# EAGLE design lzond1 (EAGLE 7.2.0)
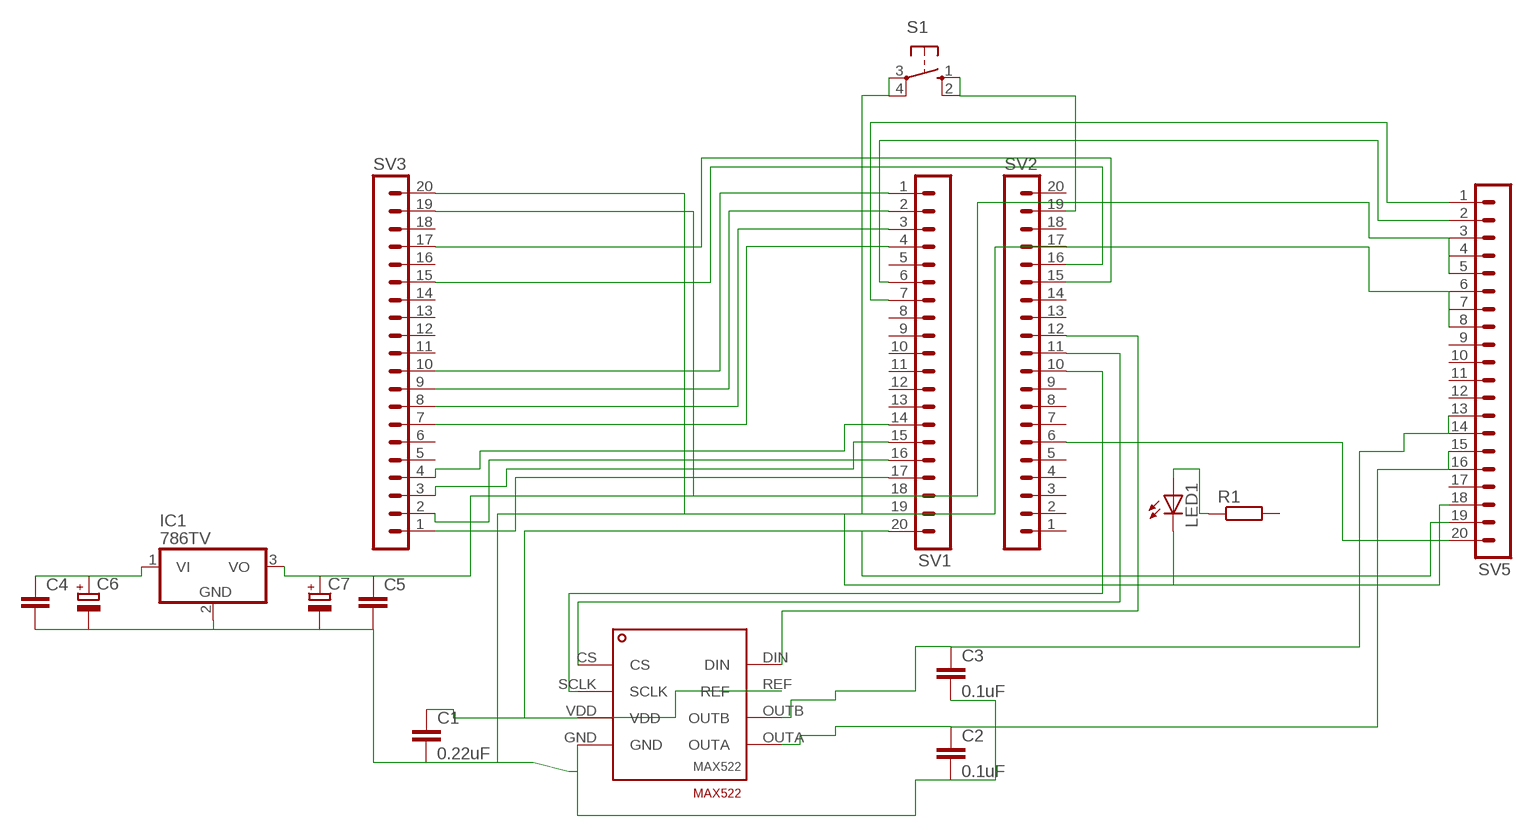
[diagram p0: schematic, sheet 1]

## Parts
C1  0.22uF  C-EUC0805  [C0805]
C2  0.1uF  C-EUC0805  [C0805]
C3  0.1uF  C-EUC0805  [C0805]
C4  C-EUC1210  [C1210]
C5  C-EUC1210  [C1210]
C6  CPOL-EUE5-8.5  [E5-8,5]
C7  CPOL-EUE5-8.5  [E5-8,5]
IC1  786TV  [TO220V]
LED1  LED3MM  [LED3MM]
R1  R-EU_R0805  [R0805]
S1  10-XX  [B3F-10XX]
SV1  MA20-1  [MA20-1]
SV2  MA20-1  [MA20-1]
SV3  MA20-1  [MA20-1]
SV5  MA20-1  [MA20-1]
U$2  MAX522  [MAX522]

## Nets
N$1: SV1.4 SV3.7
N$2: SV1.3 SV3.8
N$3: SV1.2 SV3.9
N$4: C4.1 C6.+ IC1.1(VI)
N$5: SV1.1 SV3.10
N$6: C1.1 SV1.20 SV5.19 U$2.REF U$2.VDD
N$7: LED1.A R1.1
N$8: C1.2 C2.2 C3.2 C4.2 C5.2 C6.- C7.- IC1.2(GND) LED1.K(C) S1.3(P) S1.4(P1) SV1.19 SV3.20 SV5.6 SV5.7 SV5.8 SV5.18 U$2.GND
N$9: SV2.16 SV3.15
N$10: SV2.15 SV3.17
N$12: SV1.6 SV5.2
N$13: SV2.12 U$2.DIN
N$14: SV2.11 U$2.CS
N$15: SV2.10 U$2.SCLK
N$16: S1.1(S) S1.2(S1) SV2.19
N$17: SV1.7 SV5.1
N$18: SV2.6 SV5.20
N$20: SV1.17 SV3.1
N$21: C5.1 C7.+ IC1.3(VO) SV1.18 SV3.19 SV5.3 SV5.4 SV5.5
N$22: SV1.16 SV3.2
N$23: SV1.15 SV3.3
N$24: SV1.14 SV3.4
N$29: C3.1 SV5.13 SV5.14 U$2.OUTB
N$30: C2.1 SV5.15 SV5.16 U$2.OUTA
Unconnected: R1.2 SV1.5 SV1.8 SV1.9 SV1.10 SV1.11 SV1.12 SV1.13 SV2.1 SV2.2 SV2.3 SV2.4 SV2.5 SV2.7 SV2.8 SV2.9 SV2.13 SV2.14 SV2.17 SV2.18 SV2.20 SV3.5 SV3.6 SV3.11 SV3.12 SV3.13 SV3.14 SV3.16 SV3.18 SV5.9 SV5.10 SV5.11 SV5.12 SV5.17

## Library data of the parts
C1-C3 = rcl:C-EU: CAPACITOR, European symbol
C4 C5 = resistor:C-EU: CAPACITOR, European symbol
C6 C7 = rcl:CPOL-EU: POLARIZED CAPACITOR, European symbol
IC1 = linear:78*: Positive VOLTAGE REGULATOR Source: http://cache.national.com/ds/LM/LM78L05.pdf http://www.fairchildsemi.com/ds/LM/LM7805.pdf
LED1 = led:LED: LED OSRAM: - CHIPLED LG R971, LG N971, LY N971, LG Q971, LY Q971, LO R971, LY R971 LH N974, LH R974 LS Q976, LO Q976, LY Q976 LO Q996 - Hyper CHIPLED LW Q18S LB Q993, LB Q99A, LB R99A - SideLED LS A670, LO A670, LY A670, LG A670, LP A670 LB A673, LV A673, LT A673, LW A673 LH A674 LY A675 LS A676, LA A676, LO A676, LY A676, LW A676 LS A679, LY A679, LG A679 - Hyper Micro SIDELED® LS Y876, LA Y876, LO Y876, LY Y876 LT Y87S - SmartLED LW L88C, LW L88S LB L89C, LB L89S, LG L890 LS L89K, LO L89K, LY L89K LS L896, LA L896, LO L896, LY L896 - TOPLED LS T670, LO T670, LY T670, LG T670, LP T670 LSG T670, LSP T670, LSY T670, LOP T670, LYG T670 LG T671, LOG T671, LSG T671 LB T673, LV T673, LT T673, LW T673 LH T674 LS T676, LA T676, LO T676, LY T676, LB T676, LH T676, LSB T676, LW T676 LB T67C, LV T67C, LT T67C, LS T67K, LO T67K, LY T67K, LW E67C LS E67B, LA E67B, LO E67B, LY E67B, LB E67C, LV E67C, LT E67C LW T67C LS T679, LY T679, LG T679 LS T770, LO T770, LY T770, LG T770, LP T770 LB T773, LV T773, LT T773, LW T773 LH T774 LS E675, LA E675, LY E675, LS T675 LS T776, LA T776, LO T776, LY T776, LB T776 LHGB T686 LT T68C, LB T68C - Hyper Mini TOPLED® LB M676 - Mini TOPLED Santana® LG M470 LS M47K, LO M47K, LY M47K Source: http://www.osram.convergy.de LUXEON: - LUMILED® LXK2-PW12-R00, LXK2-PW12-S00, LXK2-PW14-U00, LXK2-PW14-V00 LXK2-PM12-R00, LXK2-PM12-S00, LXK2-PM14-U00 LXK2-PE12-Q00, LXK2-PE12-R00, LXK2-PE12-S00, LXK2-PE14-T00, LXK2-PE14-U00 LXK2-PB12-K00, LXK2-PB12-L00, LXK2-PB12-M00, LXK2-PB14-N00, LXK2-PB14-P00, LXK2-PB14-Q00 LXK2-PR12-L00, LXK2-PR12-M00, LXK2-PR14-Q00, LXK2-PR14-R00 LXK2-PD12-Q00, LXK2-PD12-R00, LXK2-PD12-S00 LXK2-PH12-R00, LXK2-PH12-S00 LXK2-PL12-P00, LXK2-PL12-Q00, LXK2-PL12-R00 Source: www.luxeon.com KINGBRIGHT: KA-3528ASYC Source: www.kingbright.com
R1 = resistor:R-EU_: RESISTOR, European symbol
S1 = switch-omron:10-XX: OMRON SWITCH; MPN: B3F-1000; OC_FARNELL: 176432; OC_NEWARK: 36M3542
SV1-SV3 SV5 = con-lstb:MA20-1: PIN HEADER; OC_FARNELL: unknown; OC_NEWARK: unknown
U$2 = MAX522:MAX522

## Board
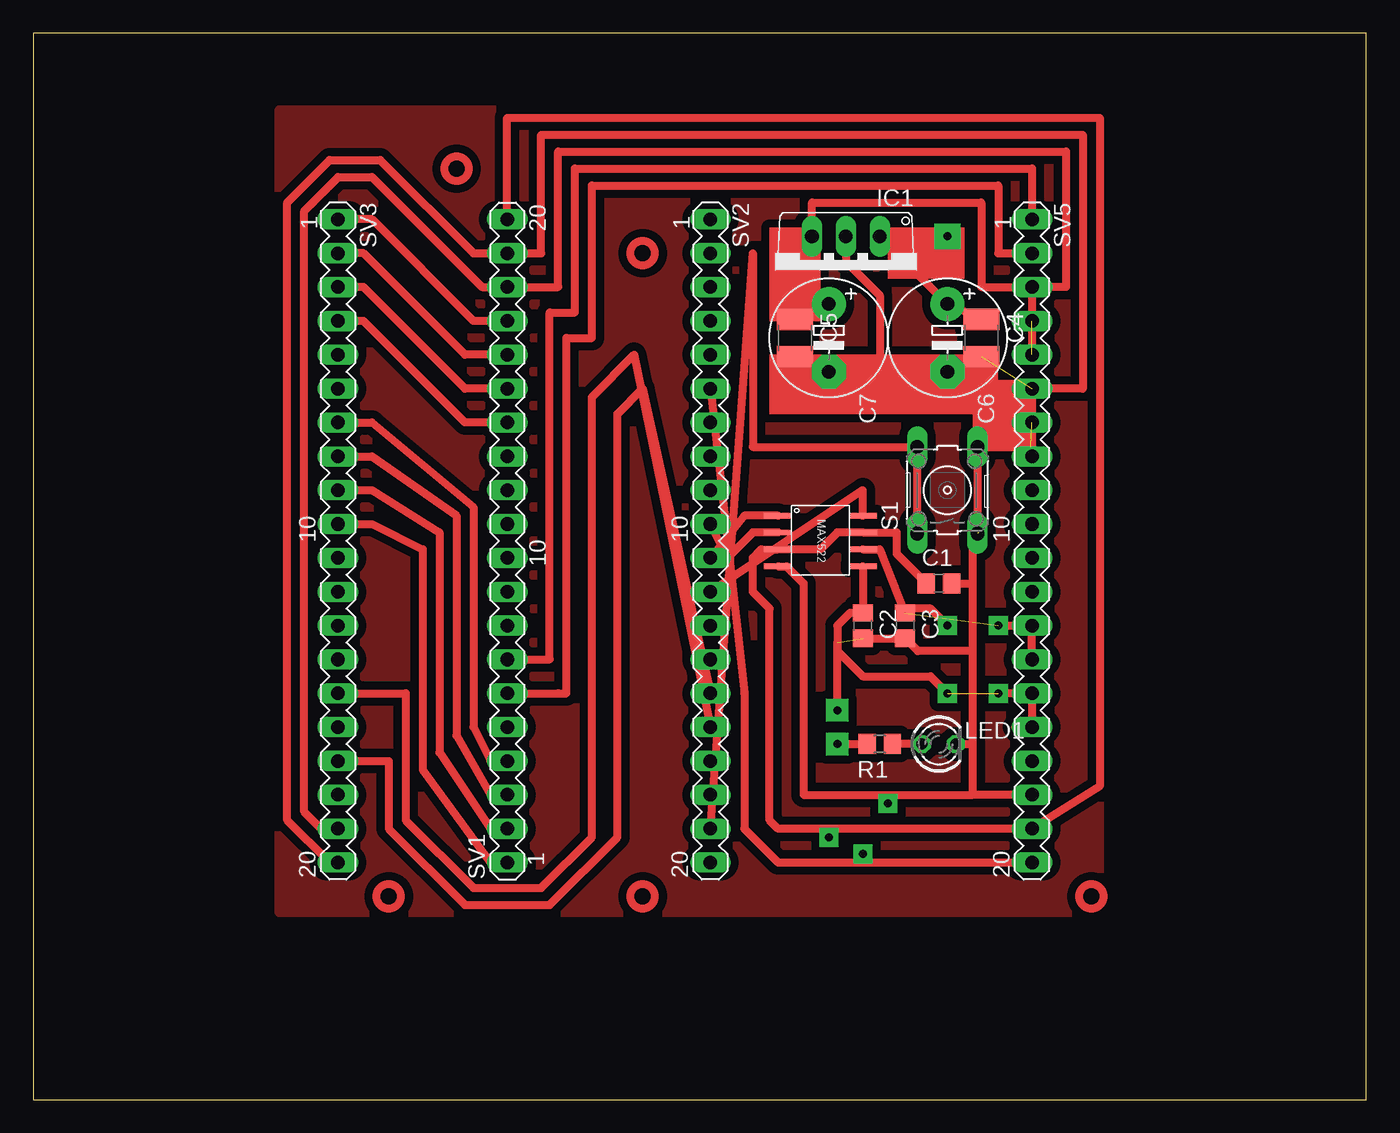
[diagram p1: board, top side]

Size 100 x 80 mm. Coordinates in mm from the lower left corner, seen from the top.
Outline: 0,0 100,0 100,80 0,80 0,0
Copper layers (1*16): Top 0.035mm / dielectric 1.5mm / Bottom 0.035mm
Design rules "default": minimum track width 10mil, minimum drill 24mil, track to track 8mil, track to pad 8mil, pad to pad 8mil, via to via 8mil, smd to smd 8mil, copper to edge 40mil, drill to drill 8mil, minimum pad ring 10mil, minimum via ring 8mil, stop-mask expansion 4mil, vias tented up to drill 0mil, thermal gap 10mil

### Footprints (pad centres in the part's own frame; a part is rotated, then mirrored left to right if it is on the bottom)
C0805 = smd 1.3 x 1.5: 1 -0.95,0; 2 0.95,0
C1210 = smd 1.6 x 2.7: 1 -1.4,0; 2 1.4,0
E5-8,5 = drill 1.016 pad 2.54: + -2.54,0 | drill 1.016 pad 2.54 octagon: - 2.54,0
TO220V = drill 1.016 long: 1 -2.54,-2.54; 2 0,-2.54; 3 2.54,-2.54
LED3MM = drill 0.813 octagon: A -1.27,0; K 1.27,0
R0805 = smd 1.3 x 1.5: 1 -0.95,0; 2 0.95,0
B3F-10XX = drill 1.016 long: 1 -3.251,2.261; 2 3.251,2.261; 3 -3.251,-2.261; 4 3.251,-2.261
MA20-1 = drill 1.016 long: 1 -24.13,0; 2 -21.59,0; 3 -19.05,0; 4 -16.51,0; 5 -13.97,0; 6 -11.43,0; 7 -8.89,0; 8 -6.35,0; 9 -3.81,0; 10 -1.27,0; 11 1.27,0; 12 3.81,0; 13 6.35,0; 14 8.89,0; 15 11.43,0; 16 13.97,0; 17 16.51,0; 18 19.05,0; 19 21.59,0; 20 24.13,0
MAX522 = smd 2.1 x 0.406: CS -2.54,1.27; DIN 3.81,1.27; GND -2.54,-2.54; OUTA 3.81,-2.54; OUTB 3.81,-1.27; REF 3.81,0; SCLK -2.54,0; VDD -2.54,-1.27

### Placement (x,y rotation side)
C1  67.94,38.73 0 top
C2  62.23,35.56 270 top
C3  65.41,35.56 270 top
C4  71.12,57.15 270 top
C5  57.15,57.15 270 top
C6  68.58,57.15 270 top
C7  59.69,57.15 270 top
IC1  60.96,62.23 180 top
LED1  67.94,26.67 0 top
R1  63.5,26.67 180 top
S1  68.58,45.72 90 top
SV1  35.56,41.91 90 top
SV2  50.8,41.91 270 top
SV3  22.86,41.91 270 top
SV5  74.93,41.91 270 top
U$2  58.42,42.55 0 top

### Tracks (layer width: path | path; a pad name or v marks a point on that pad's centre or on a via)
N$1
  Top 0.61: SV3.7 25.4,50.8 33.02,44.45 33.02,27.94 34.29,25.4 SV1.4
N$2
  Top 0.61: SV3.8 25.4,48.26 31.75,43.81 31.75,27.3 34.29,22.86 SV1.3
N$3
  Top 0.61: SV3.9 25.4,45.72 30.48,42.55 30.48,26.04 34.29,20.32 SV1.2
N$4  (via drill 0.6 pad 1.93)
  Top 0.61: C4.1 C6.+ IC1.1 v68.58,64.77
N$5
  Top 0.61: SV3.10 25.4,43.18 29.21,41.27 29.21,24.77 34.29,17.78 SV1.1
N$6
  Top 0.61: SV1.20 35.56,73.66 80.01,73.66 80.01,23.5 SV5.19 55.88,20.32 55.24,20.95 55.24,36.83 53.98,38.1 53.98,40.64 54.61,41.27 U$2.VDD 59.05,41.27 60.33,42.55 U$2.REF 64.77,42.55 64.77,40.96 C1.1
N$7
  Top 0.61: LED1.A R1.1
N$8  (via drill 0.6 pad 1.68)  (4 unrouted)
  Top 0.61: 74.93,48.9 SV5.6 78.74,53.34 78.74,72.39 38.1,72.39 38.1,63.5 SV1.19 33.02,63.5 26.04,70.48 22.23,70.48 19.05,67.31 19.05,20.95 22.23,17.78 SV3.20 | 74.93,48.9 SV5.8 | C2.2 C3.2 66.36,33.66 70.48,33.66 | 70.48,22.86 57.78,22.86 57.78,38.73 56.52,40.01 U$2.GND | S1.3 S1.4 74.85,48.97 74.93,48.9 | 63.5,54.61 C7.- C5.2 | 63.5,54.61 C6.- C4.2 | IC1.2 60.96,62.87 63.5,60.33 63.5,54.61 | 70.48,33.66 70.48,38.73 | 70.48,38.73 70.48,42.55 70.92,42.55 | SV5.18 70.48,22.86 | C1.2 70.48,38.73 | 70.48,22.86 70.48,26.67 | 70.48,26.67 70.48,33.66 | LED1.K 70.48,26.67 | v60.33,29.21 60.33,34.29
N$9
  Top 0.61: SV3.15 27.94,30.48 27.94,20.95 33.02,15.88 38.1,15.88 41.91,19.68 41.91,52.7 45.09,55.88 SV2.16
N$10
  Top 0.61: SV3.17 26.67,25.4 26.67,20.32 32.38,14.61 38.73,14.61 43.81,19.68 43.81,51.44 45.72,53.34 SV2.15
N$11  (via drill 0.6 pad 1.42)
  other vias: 62.23,18.41
N$12
  Top 0.61: SV1.6 39.37,30.48 40.01,30.48 40.01,57.15 41.91,57.15 41.91,68.58 72.39,68.58 72.39,63.5 SV5.2
N$13
  Top 0.61: U$2.DIN 62.23,45.72 SV2.12
N$14
  Top 0.61: U$2.CS 53.34,43.81 SV2.11
N$15
  Top 0.61: U$2.SCLK 53.98,42.55 52.07,40.64 SV2.10
N$16
  Top 0.61: SV2.19 53.98,63.5 53.98,48.97 S1.2 S1.1
N$17
  Top 0.61: SV1.7 38.73,33.02 38.73,59.05 40.64,59.05 40.64,69.85 74.93,69.85 SV5.1
N$18
  Top 0.61: SV2.6 53.34,30.48 53.34,20.32 55.88,17.78 SV5.20
N$19
  pour Top (isolate 0.61): 18.41,74.3 80.01,74.3 80.01,13.97 18.41,13.97
N$20
  Top 0.61: SV1.17 33.02,58.42 25.4,66.04 SV3.1
N$21  (1 unrouted)
  Top 0.61: SV5.3 77.47,60.96 77.47,71.12 39.37,71.12 39.37,60.96 SV1.18 33.66,60.96 25.4,69.22 22.86,69.22 20.32,66.67 20.32,21.59 21.59,20.32 SV3.19 | SV5.3 SV5.5 | SV5.3 71.12,60.96 71.12,67.31 58.42,67.31 IC1.3 58.42,59.05 C7.+ C5.1
N$22
  Top 0.61: SV1.16 32.38,55.88 24.77,63.5 SV3.2
N$23
  Top 0.61: SV1.15 32.38,53.34 24.77,60.96 SV3.3
N$24
  Top 0.61: SV1.14 32.38,50.8 24.77,58.42 SV3.4
N$25  (via drill 0.6 pad 1.42)
  other vias: 59.69,19.68
N$26  (via drill 0.6 pad 1.42)
  other vias: 64.14,22.23
N$28  (via drill 0.6 pad 1.42)
  Top 0.61: v68.58,35.56 67.31,36.83 65.41,36.83
N$29  (via drill 0.6 pad 1.42)  (1 unrouted)
  Top 0.61: U$2.OUTB 63.5,41.27 C3.1 | v72.39,35.56 SV5.13 SV5.14
N$30  (via drill 0.6 pad 1.42)  (1 unrouted)
  Top 0.61: 73.66,27.94 SV5.16 SV5.15 v72.39,30.48 | U$2.OUTA C2.1 61.27,36.51 60.33,35.56 60.33,33.66 62.23,31.75 67.31,31.75 v68.58,30.48
N$31  (via drill 0.6 pad 1.68)
  Top 0.61: v60.33,26.67 62.87,26.67
(copper drawn outside any net)
  shapes: Top area x4, Top circle x5